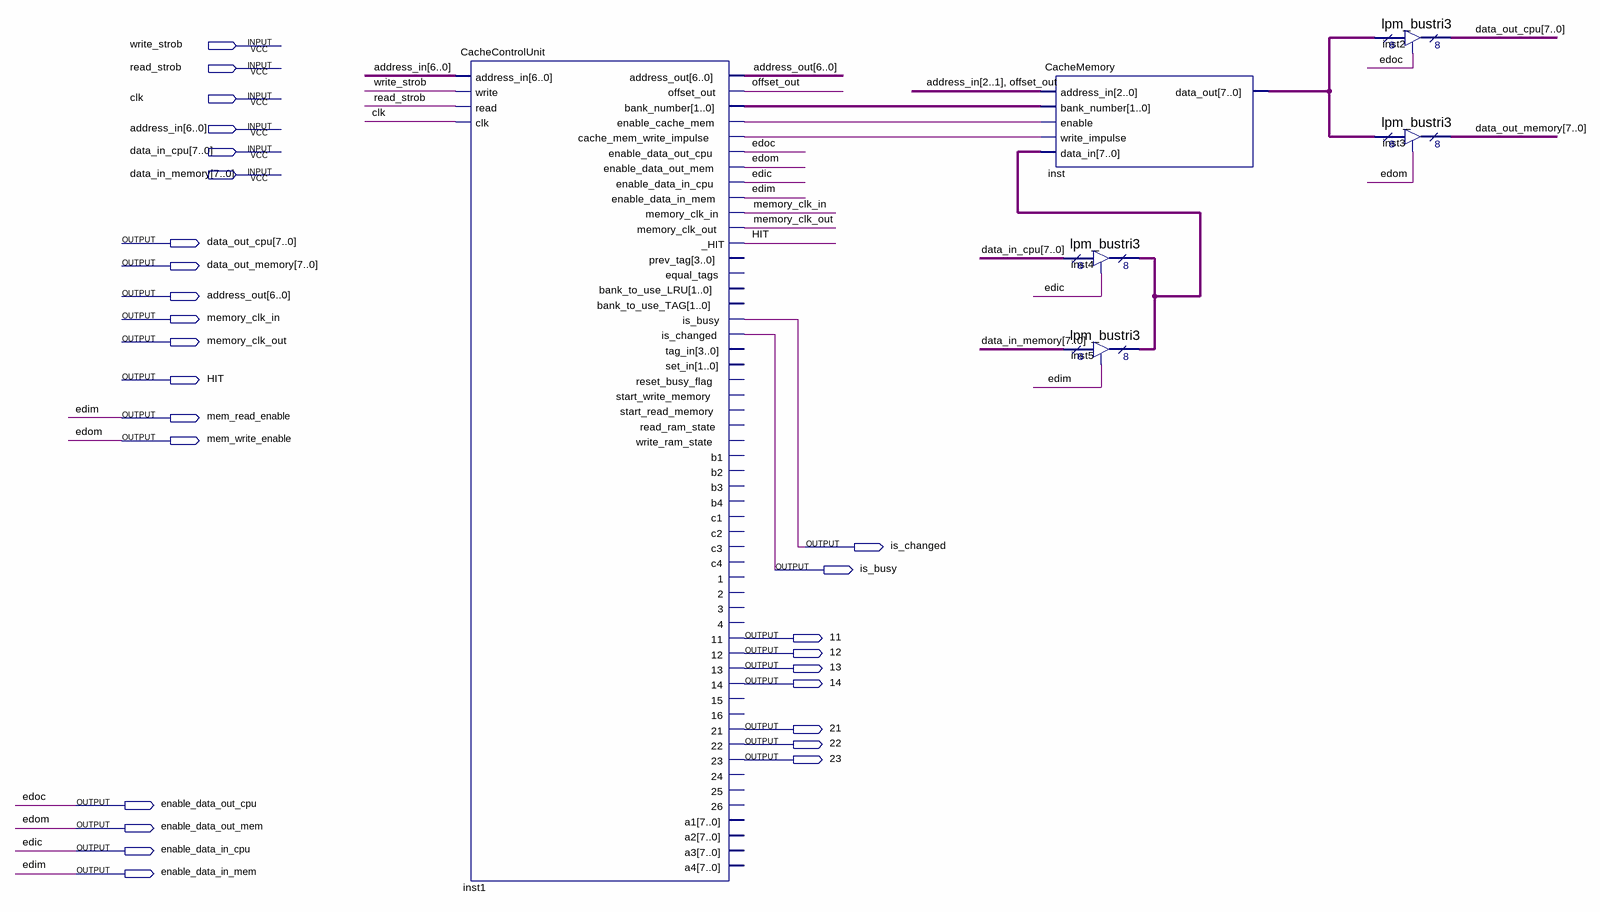
[diagram p0: schematic sheet]
// Quartus schematic Cache.bdf as structural Verilog: 6 symbols, 27 pins
module Cache (
  input  write_strob,
  input  read_strob,
  input  clk,
  input  [6:0] address_in,
  input  [7:0] data_in_cpu,
  input  [7:0] data_in_memory,
  output [7:0] data_out_cpu,
  output [7:0] data_out_memory,
  output [6:0] address_out,
  output memory_clk_in,
  output memory_clk_out,
  output HIT,
  output mem_read_enable,
  output mem_write_enable,
  output is_changed,
  output is_busy,
  output \11 ,
  output \12 ,
  output \13 ,
  output \14 ,
  output \21 ,
  output \22 ,
  output \23 ,
  output enable_data_out_cpu,
  output enable_data_out_mem,
  output enable_data_in_cpu,
  output enable_data_in_mem
);

  wire inst1_cache_mem_write_impulse, inst1_enable_cache_mem, offset_out;
  wire [1:0] inst1_bank_number;
  wire [7:0] inst4_tridata, inst_data_out;

  CacheControlUnit inst1 (
    .address_in(address_in), .write(write_strob), .read(read_strob), .clk(clk), .address_out(address_out),
    .offset_out(offset_out), .bank_number(inst1_bank_number), .enable_cache_mem(inst1_enable_cache_mem),
    .cache_mem_write_impulse(inst1_cache_mem_write_impulse), .enable_data_out_cpu(enable_data_out_cpu),
    .enable_data_out_mem(enable_data_out_mem), .enable_data_in_cpu(enable_data_in_cpu),
    .enable_data_in_mem(enable_data_in_mem), .memory_clk_in(memory_clk_in), .memory_clk_out(memory_clk_out),
    ._HIT(HIT), .is_busy(is_changed), .is_changed(is_busy), .\11 (\11 ), .\12 (\12 ), .\13 (\13 ),
    .\14 (\14 ), .\21 (\21 ), .\22 (\22 ), .\23 (\23 ));  // open: prev_tag, equal_tags, bank_to_use_LRU, bank_to_use_TAG, tag_in, set_in, reset_busy_flag, start_write_memory, start_read_memory, read_ram_state, write_ram_state, b1, b2, b3, b4, c1, c2, c3, c4, 1, 2, 3, 4, 15, 16, 24, 25, 26, a1, a2, a3, a4
  CacheMemory inst (
    .address_in({address_in[2:1], offset_out}), .bank_number(inst1_bank_number),
    .enable(inst1_enable_cache_mem), .write_impulse(inst1_cache_mem_write_impulse), .data_in(inst4_tridata),
    .data_out(inst_data_out));
  lpm_bustri3 inst4 (.enabledt(enable_data_in_cpu), .data(data_in_cpu), .tridata(inst4_tridata));
  lpm_bustri3 inst5 (.enabledt(enable_data_in_mem), .data(data_in_memory), .tridata(inst4_tridata));
  lpm_bustri3 inst2 (.enabledt(enable_data_out_cpu), .data(inst_data_out), .tridata(data_out_cpu));
  lpm_bustri3 inst3 (.enabledt(enable_data_out_mem), .data(inst_data_out), .tridata(data_out_memory));

  assign mem_read_enable = enable_data_in_mem;
  assign mem_write_enable = enable_data_out_mem;

  // Other names for the same wires on the sheet: edic = enable_data_in_cpu; edim = enable_data_in_mem;
  //   edoc = enable_data_out_cpu; edom = enable_data_out_mem
endmodule
